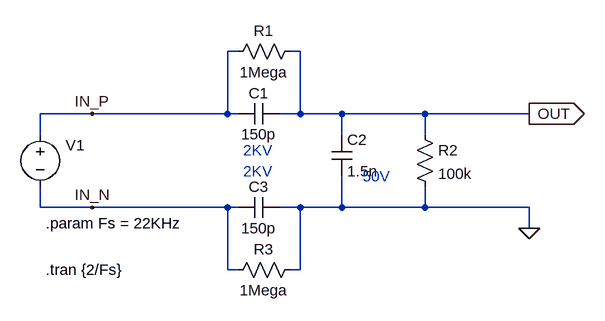
[diagram p0: schematic v2.0.asc]
v2.0.asc, the LTspice schematic file:
Version 4.1
SHEET 1 880 680
WIRE 48 48 32 48
WIRE 144 48 128 48
WIRE -176 144 -256 144
WIRE 32 144 32 48
WIRE 32 144 -176 144
WIRE 48 144 32 144
WIRE 144 144 144 48
WIRE 144 144 112 144
WIRE 208 144 144 144
WIRE 336 144 208 144
WIRE 496 144 336 144
WIRE -256 176 -256 144
WIRE 208 176 208 144
WIRE 336 176 336 144
WIRE -256 288 -256 256
WIRE -176 288 -256 288
WIRE 32 288 -176 288
WIRE 48 288 32 288
WIRE 144 288 112 288
WIRE 208 288 208 240
WIRE 208 288 144 288
WIRE 336 288 336 256
WIRE 336 288 208 288
WIRE 496 288 336 288
WIRE 496 320 496 288
WIRE 32 384 32 288
WIRE 48 384 32 384
WIRE 144 384 144 288
WIRE 144 384 128 384
FLAG 496 320 0
FLAG 496 144 OUT
IOPIN 496 144 Out
FLAG -176 288 IN_N
FLAG -176 144 IN_P
SYMBOL cap 48 160 R270
WINDOW 0 32 32 VTop 2
WINDOW 3 0 32 VBottom 2
SYMATTR InstName C1
SYMATTR Value 150p
SYMATTR SpiceLine V=2k
SYMBOL res 32 64 R270
WINDOW 0 32 56 VTop 2
WINDOW 3 0 56 VBottom 2
SYMATTR InstName R1
SYMATTR Value 1Mega
SYMBOL cap 192 176 R0
SYMATTR InstName C2
SYMATTR Value 1.5n
SYMATTR SpiceLine V=50
SYMBOL res 320 160 R0
SYMATTR InstName R2
SYMATTR Value 100k
SYMBOL cap 48 304 R270
WINDOW 0 32 32 VTop 2
WINDOW 3 0 32 VBottom 2
SYMATTR InstName C3
SYMATTR Value 150p
SYMATTR SpiceLine V=2k
SYMBOL res 32 400 R270
WINDOW 0 32 56 VTop 2
WINDOW 3 0 56 VBottom 2
SYMATTR InstName R3
SYMATTR Value 1Mega
SYMBOL voltage -256 160 R0
WINDOW 0 39 32 Left 2
WINDOW 3 43 70 Invisible 2
WINDOW 123 0 0 Left 0
WINDOW 39 0 0 Left 0
SYMATTR InstName V1
SYMATTR Value PULSE(0 500 0 {0.01/Fs} {0.01/Fs} {0.5/Fs} {1/Fs})
TEXT -248 312 Left 2 !.param Fs = 22KHz
TEXT -248 384 Left 2 !.tran {2/Fs}
TEXT 56 232 Left 2 ;2KV
TEXT 56 200 Left 2 ;2KV
TEXT 240 240 Left 2 ;50V

The netlist it stands for:
* v2.0.asc
C1 IN_P OUT 150p V=2k
R1 IN_P OUT 1Mega
C2 OUT 0 1.5n V=50
R2 OUT 0 100k
C3 IN_N 0 150p V=2k
R3 IN_N 0 1Mega
V1 IN_P IN_N PULSE(0 500 0 {0.01/Fs} {0.01/Fs} {0.5/Fs} {1/Fs})
.param Fs = 22KHz
.tran {2/Fs}
* 2KV
* 2KV
* 50V
.backanno
.end